# EAGLE design TQFP48_breakout (EAGLE 5.10)
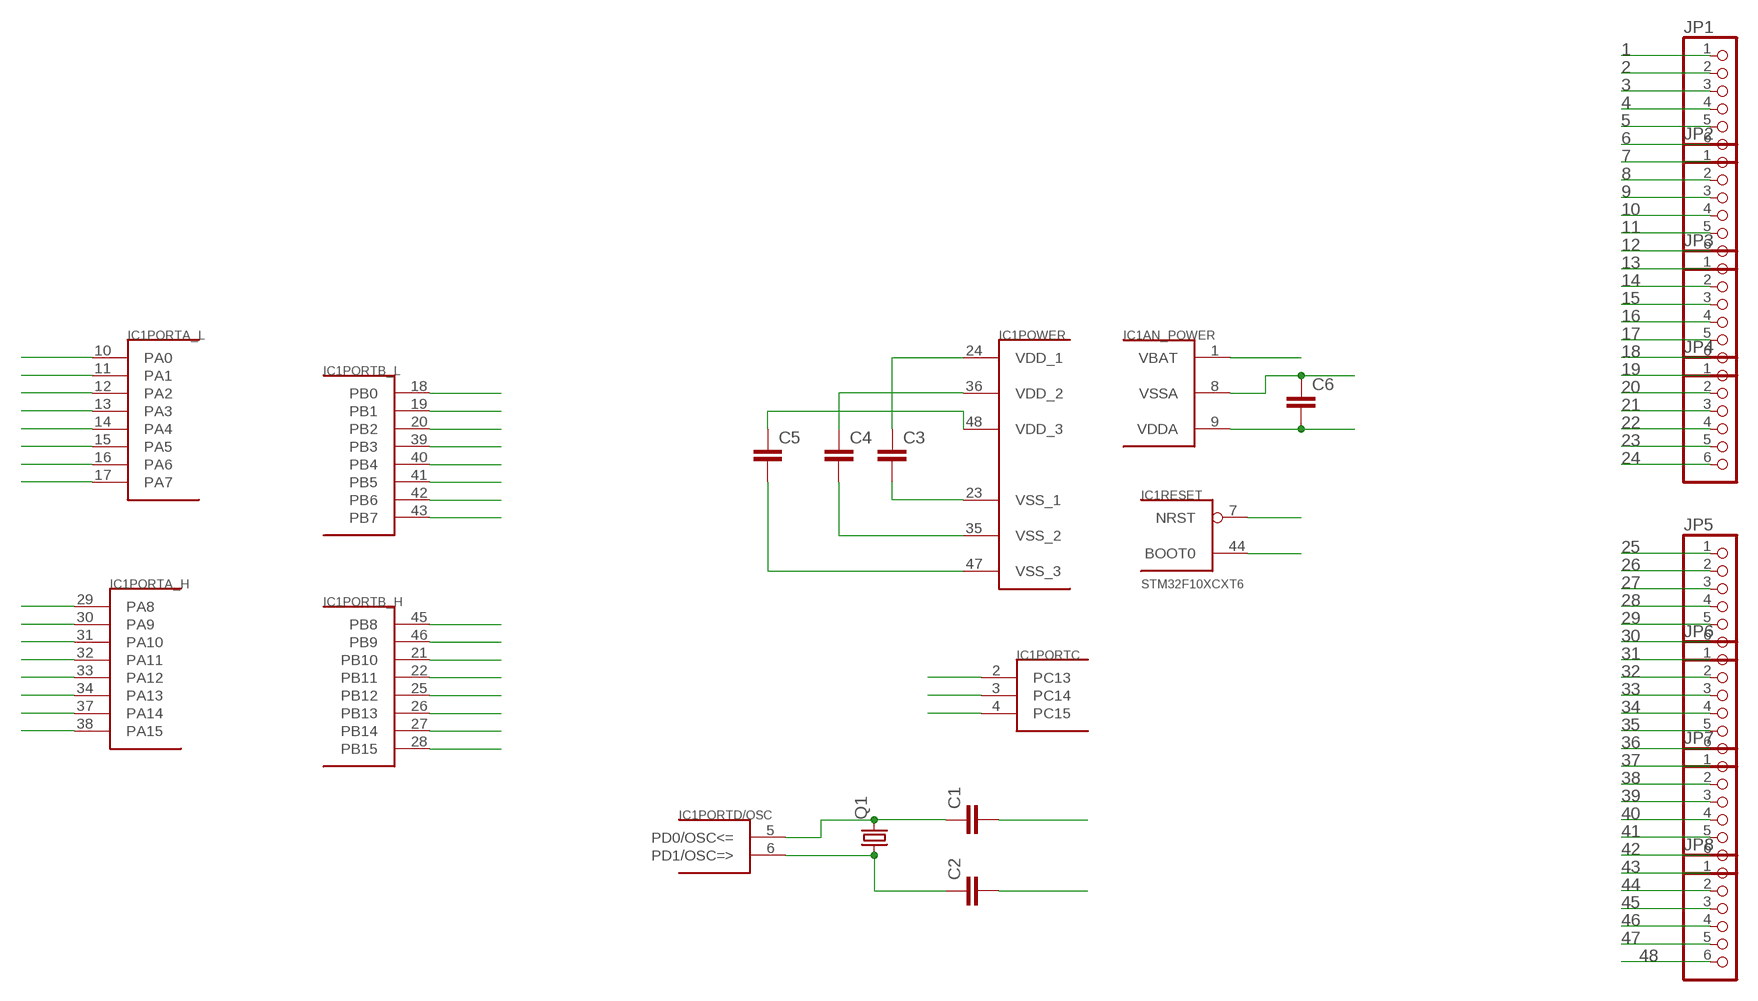
[diagram p0: schematic, sheet 1]

## Parts
C1  CAP1206  [1206]
C2  CAP1206  [1206]
C3  CAP1206  [1206]
C4  CAP1206  [1206]
C5  CAP1206  [1206]
C6  CAP1206  [1206]
IC1  STM32F10XCXT6  [TQFP48]
JP1  PINHD-1X6  [1X06]
JP2  PINHD-1X6  [1X06]
JP3  PINHD-1X6  [1X06]
JP4  PINHD-1X6  [1X06]
JP5  PINHD-1X6  [1X06]
JP6  PINHD-1X6  [1X06]
JP7  PINHD-1X6  [1X06]
JP8  PINHD-1X6  [1X06]
Q1  CRYSTAL5X3  [CRYSTAL-SMD-5X3]

## Nets
1: IC1.1(AN_POWER:VBAT) JP1.1
2: IC1.2(PORTC:PC13) JP1.2
3: IC1.3(PORTC:PC14) JP1.3
4: IC1.4(PORTC:PC15) JP1.4
5: C1.2 JP1.5
6: C2.2 JP1.6
7: IC1.7(RESET:NRST) JP2.1
8: C6.1 IC1.8(AN_POWER:VSSA) JP2.2
9: C6.2 IC1.9(AN_POWER:VDDA) JP2.3
10: IC1.10(PORTA_L:PA0) JP2.4
11: IC1.11(PORTA_L:PA1) JP2.5
12: IC1.12(PORTA_L:PA2) JP2.6
13: IC1.13(PORTA_L:PA3) JP3.1
14: IC1.14(PORTA_L:PA4) JP3.2
15: IC1.15(PORTA_L:PA5) JP3.3
16: IC1.16(PORTA_L:PA6) JP3.4
17: IC1.17(PORTA_L:PA7) JP3.5
18: IC1.18(PORTB_L:PB0) JP3.6
19: IC1.19(PORTB_L:PB1) JP4.1
20: IC1.20(PORTB_L:PB2) JP4.2
21: IC1.21(PORTB_H:PB10) JP4.3
22: IC1.22(PORTB_H:PB11) JP4.4
23: C3.2 IC1.23(POWER:VSS_1) JP4.5
24: C3.1 IC1.24(POWER:VDD_1) JP4.6
25: IC1.25(PORTB_H:PB12) JP5.1
26: IC1.26(PORTB_H:PB13) JP5.2
27: IC1.27(PORTB_H:PB14) JP5.3
28: IC1.28(PORTB_H:PB15) JP5.4
29: IC1.29(PORTA_H:PA8) JP5.5
30: IC1.30(PORTA_H:PA9) JP5.6
31: IC1.31(PORTA_H:PA10) JP6.1
32: IC1.32(PORTA_H:PA11) JP6.2
33: IC1.33(PORTA_H:PA12) JP6.3
34: IC1.34(PORTA_H:PA13) JP6.4
35: C4.2 IC1.35(POWER:VSS_2) JP6.5
36: C4.1 IC1.36(POWER:VDD_2) JP6.6
37: IC1.37(PORTA_H:PA14) JP7.1
38: IC1.38(PORTA_H:PA15) JP7.2
39: IC1.39(PORTB_L:PB3) JP7.3
40: IC1.40(PORTB_L:PB4) JP7.4
41: IC1.41(PORTB_L:PB5) JP7.5
42: IC1.42(PORTB_L:PB6) JP7.6
43: IC1.43(PORTB_L:PB7) JP8.1
44: IC1.44(RESET:BOOT0) JP8.2
45: IC1.45(PORTB_H:PB8) JP8.3
46: IC1.46(PORTB_H:PB9) JP8.4
47: C5.2 IC1.47(POWER:VSS_3) JP8.5
48: C5.1 IC1.48(POWER:VDD_3) JP8.6
N$9: C1.1 IC1.5(PORTD/OSC:PD0/OSC<=) Q1.3
N$10: C2.1 IC1.6(PORTD/OSC:PD1/OSC=>) Q1.1

## Library data of the parts
C1-C6 = SparkFun:CAP: Capacitor Standard 0603 ceramic capacitor, and 0.1" leaded capacitor.
IC1 = stm32:STM32F10XCXT6: ST STM32F101/103 48pin LQFP
JP1-JP8 = pinhead:PINHD-1X6: PIN HEADER
Q1 = SparkFun:CRYSTAL: Crystals Various standard crystals. Proven footprints. Spark Fun Electronics SKU : COM-00534

## Board
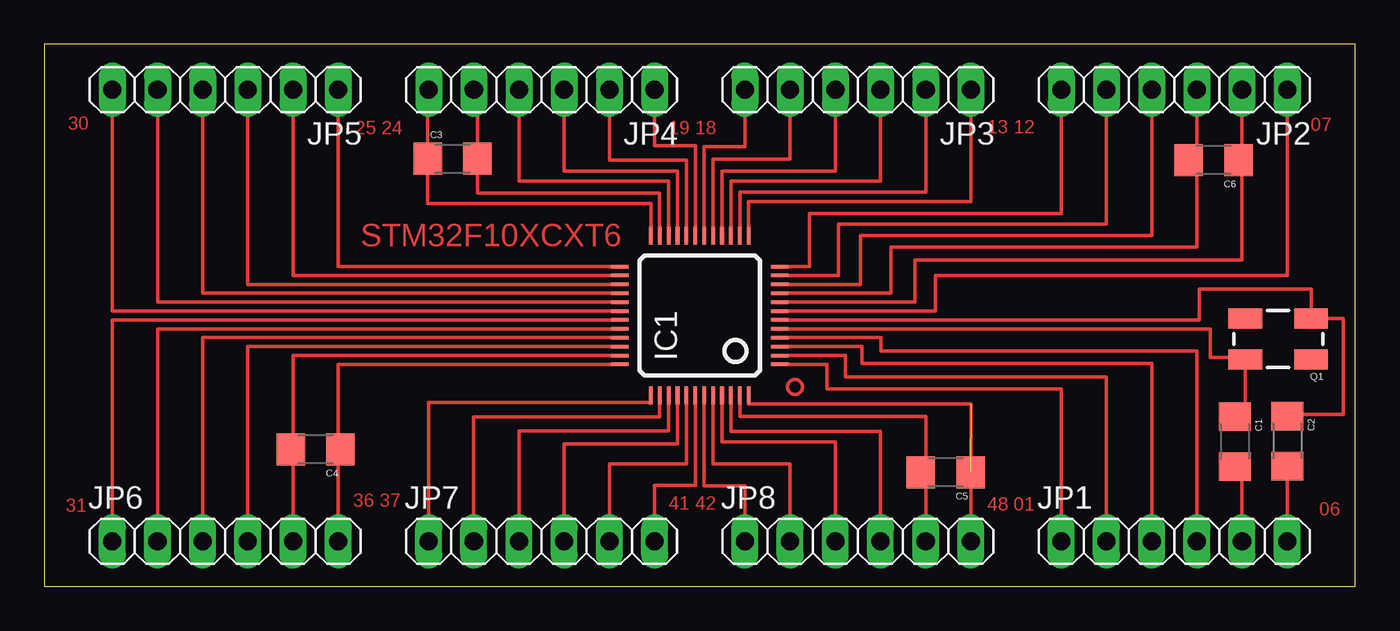
[diagram p1: board, top side]

Size 73.66 x 30.48 mm. Coordinates in mm from the lower left corner, seen from the top.
Outline: 0,0 73.66,0 73.66,30.48 0,30.48 0,0
Copper layers (1*16): Top 0.035mm / dielectric 1.5mm / Bottom 0.035mm
Design rules "default *": minimum track width 8mil, minimum drill 24mil, track to track 8mil, track to pad 8mil, pad to pad 8mil, via to via 8mil, smd to smd 8mil, copper to edge 40mil, drill to drill 8mil, minimum pad ring 10mil, minimum via ring 8mil, stop-mask expansion 4mil, vias tented up to drill 0mil, thermal gap 10mil

### Footprints (pad centres in the part's own frame; a part is rotated, then mirrored left to right if it is on the bottom)
1206 = smd 1.6 x 1.8: 1 -1.4,0; 2 1.4,0
TQFP48 = smd 0.2 x 1: 1 -2.75,-4.5; 2 -2.25,-4.5; 3 -1.75,-4.5; 4 -1.25,-4.5; 5 -0.75,-4.5; 6 -0.25,-4.5; 7 0.25,-4.5; 8 0.75,-4.5; 9 1.25,-4.5; 10 1.75,-4.5; 11 2.25,-4.5; 12 2.75,-4.5; 25 2.75,4.5; 26 2.25,4.5; 27 1.75,4.5; 28 1.25,4.5; 29 0.75,4.5; 30 0.25,4.5; 31 -0.25,4.5; 32 -0.75,4.5; 33 -1.25,4.5; 34 -1.75,4.5; 35 -2.25,4.5; 36 -2.75,4.5 | smd 1 x 0.2: 13 4.5,-2.75; 14 4.5,-2.25; 15 4.5,-1.75; 16 4.5,-1.25; 17 4.5,-0.75; 18 4.5,-0.25; 19 4.5,0.25; 20 4.5,0.75; 21 4.5,1.25; 22 4.5,1.75; 23 4.5,2.25; 24 4.5,2.75; 37 -4.5,2.75; 38 -4.5,2.25; 39 -4.5,1.75; 40 -4.5,1.25; 41 -4.5,0.75; 42 -4.5,0.25; 43 -4.5,-0.25; 44 -4.5,-0.75; 45 -4.5,-1.25; 46 -4.5,-1.75; 47 -4.5,-2.25; 48 -4.5,-2.75
1X06 = drill 1.016 long: 1 -6.35,0; 2 -3.81,0; 3 -1.27,0; 4 1.27,0; 5 3.81,0; 6 6.35,0
CRYSTAL-SMD-5X3 = smd 1.9 x 1.1: 1 -1.85,-1.15; 2 1.85,-1.15; 3 1.85,1.15; 4 -1.85,1.15

### Placement (x,y rotation side)
C1  66.9,8.15 270 top
C2  69.85,8.18 270 top
C3  22.94,24.05 0 top
C4  15.24,7.72 180 top
C5  50.65,6.43 180 top
C6  65.71,23.98 180 top
IC1  36.83,15.24 90 top
JP1  63.5,2.54 0 top
JP2  63.5,27.94 180 top
JP3  45.72,27.94 180 top
JP4  27.94,27.94 180 top
JP5  10.16,27.94 180 top
JP6  10.16,2.54 0 top
JP7  27.94,2.54 0 top
JP8  45.72,2.54 0 top
Q1  69.34,13.92 180 top

### Tracks (layer width: path | path; a pad name or v marks a point on that pad's centre or on a via)
1
  Top 0.203: IC1.1 43.99,12.49 43.99,11.1 57.15,11.1 JP1.1
2
  Top 0.203: IC1.2 45.01,12.99 45.01,11.79 59.69,11.79 JP1.2
3
  Top 0.203: IC1.3 45.95,13.49 45.95,12.55 62.23,12.55 JP1.3
4
  Top 0.203: IC1.4 47.02,13.99 47.02,13.26 64.77,13.26 JP1.4
5
  Top 0.203: C1.2 67.31,6.75 JP1.5
6
  Top 0.203: C2.2 JP1.6
7
  Top 0.203: JP2.1 69.85,17.5 50.06,17.5 50.06,15.49 IC1.7
8
  Top 0.203: 67.31,24.26 67.31,18.36 48.92,18.36 48.92,15.99 IC1.8 | 67.31,24.26 JP2.2 | C6.1 67.11,24.26 67.31,24.26
9
  Top 0.203: 64.77,23.93 64.77,19.07 47.57,19.07 47.57,16.49 IC1.9 | 64.77,23.93 JP2.3 | C6.2 64.31,23.93 64.77,23.93
10
  Top 0.203: JP2.4 62.23,19.74 45.87,19.74 45.87,16.99 IC1.10
11
  Top 0.203: JP2.5 59.69,20.37 44.63,20.37 44.63,17.49 IC1.11
12
  Top 0.203: JP2.6 57.15,20.98 43,20.98 43,17.99 IC1.12
13
  Top 0.203: IC1.13 39.58,21.64 52.07,21.64 JP3.1
14
  Top 0.203: IC1.14 39.08,22.17 49.53,22.17 JP3.2
15
  Top 0.203: IC1.15 38.58,22.78 46.99,22.78 JP3.3
16
  Top 0.203: IC1.16 38.08,23.37 44.45,23.37 JP3.4
17
  Top 0.203: IC1.17 37.58,24.03 41.91,24.03 JP3.5
18
  Top 0.203: IC1.18 37.08,24.74 39.37,24.74 JP3.6
19
  Top 0.203: IC1.19 36.58,24.79 34.29,24.79 JP4.1
20
  Top 0.203: IC1.20 36.08,23.98 31.75,23.98 JP4.2
21
  Top 0.203: IC1.21 35.58,23.37 29.21,23.37 JP4.3
22
  Top 0.203: IC1.22 35.08,22.78 34.01,22.78 33.81,22.78 26.67,22.78 JP4.4
23
  Top 0.203: JP4.5 24.34,27.94 C3.2 24.34,22.12 34.58,22.12 IC1.23
24
  Top 0.203: JP4.6 21.54,27.94 C3.1 21.54,21.54 32.66,21.54 32.82,21.54 34.08,21.54 IC1.24
25
  Top 0.203: IC1.25 16.51,17.99 JP5.1
26
  Top 0.203: IC1.26 13.97,17.49 JP5.2
27
  Top 0.203: IC1.27 11.43,16.99 JP5.3
28
  Top 0.203: IC1.28 8.89,16.49 JP5.4
29
  Top 0.203: IC1.29 6.35,15.99 JP5.5
30
  Top 0.203: IC1.30 3.81,15.49 JP5.6
31
  Top 0.203: IC1.31 3.81,14.99 JP6.1
32
  Top 0.203: IC1.32 6.35,14.49 JP6.2
33
  Top 0.203: IC1.33 8.89,13.99 JP6.3
34
  Top 0.203: IC1.34 11.43,13.49 JP6.4
35
  Top 0.203: IC1.35 13.97,12.99 13.97,7.72 | JP6.5 13.97,7.72 | 13.97,7.72 C4.2
36
  Top 0.203: IC1.36 16.51,12.49 16.51,7.72 | JP6.6 16.51,7.72 | 16.51,7.72 C4.1
37
  Top 0.203: IC1.37 34.08,10.34 21.59,10.34 JP7.1
38
  Top 0.203: IC1.38 34.58,9.53 24.13,9.53 JP7.2
39
  Top 0.203: IC1.39 35.08,8.76 33.35,8.76 33.22,8.76 26.67,8.76 JP7.3
40
  Top 0.203: IC1.40 35.58,8.03 29.21,8.03 JP7.4
41
  Top 0.203: IC1.41 36.08,6.91 31.75,6.91 JP7.5
42
  Top 0.203: IC1.42 36.58,5.69 34.29,5.69 JP7.6
43
  Top 0.203: IC1.43 37.08,5.66 39.37,5.66 JP8.1
44
  Top 0.203: IC1.44 37.58,6.91 41.91,6.91 JP8.2
45
  Top 0.203: IC1.45 38.08,8.13 44.45,8.13 JP8.3
46
  Top 0.203: IC1.46 38.58,8.71 46.99,8.71 JP8.4
47
  Top 0.203: IC1.47 39.08,9.58 49.53,9.58 49.53,6.43 | JP8.5 49.53,6.35 49.53,6.43 | 49.53,6.43 C5.2
48  (1 unrouted)
  Top 0.203: IC1.48 39.58,10.26 52.07,10.26 JP8.6
N$9
  Top 0.203: C1.1 67.49,9.55 Q1.3 67.49,12.88 65.53,12.88 65.53,14.49 IC1.5
N$10
  Top 0.203: IC1.6 64.9,14.99 64.9,16.74 71.19,16.74 Q1.1 73,15.07 73,9.68 69.85,9.68 C2.1
(copper drawn outside any net)
  shapes: Top circle x1

### Text on the board
Top: 30 | 07 | 25 24 | 19 18 | 13 12 | STM32F10XCXT6 | 31 | 36 37 | 41 42 | 48 01 | 06